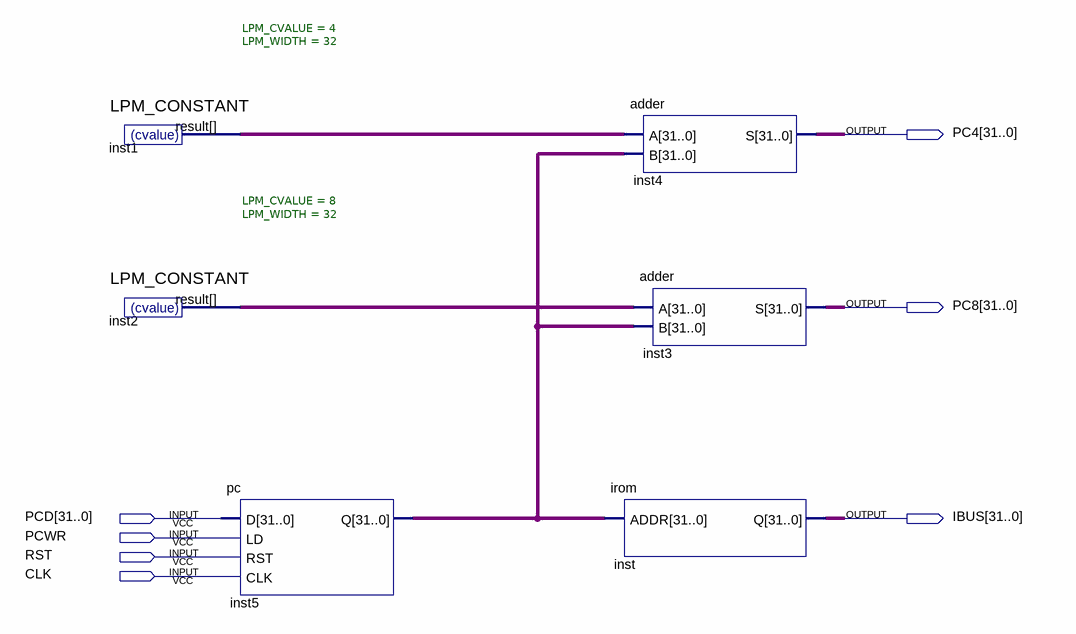
[diagram p0: schematic sheet]
// Quartus schematic fetch.bdf as structural Verilog: 6 symbols, 7 pins
module fetch (
  input  [31:0] PCD,
  input  PCWR,
  input  RST,
  input  CLK,
  output [31:0] PC4,
  output [31:0] PC8,
  output [31:0] IBUS
);

  wire [31:0] inst1_result, inst2_result, inst5_q;

  LPM_CONSTANT #(.LPM_CVALUE(4), .LPM_WIDTH(32)) inst1 (.result(inst1_result));
  LPM_CONSTANT #(.LPM_CVALUE(8), .LPM_WIDTH(32)) inst2 (.result(inst2_result));
  pc inst5 (.D(PCD), .LD(PCWR), .RST(RST), .CLK(CLK), .Q(inst5_q));
  adder inst4 (.A(inst1_result), .B(inst5_q), .S(PC4));
  adder inst3 (.A(inst2_result), .B(inst5_q), .S(PC8));
  irom inst (.ADDR(inst5_q), .Q(IBUS));
endmodule
